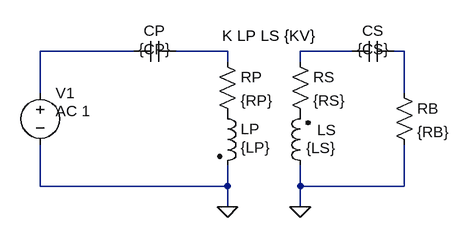
[diagram p0: schematic EVAL_WPTSIM.asc]
EVAL_WPTSIM.asc, the LTspice schematic file:
Version 4
SHEET 1 1000 692
WIRE 176 48 32 48
WIRE 320 48 240 48
WIRE 512 48 432 48
WIRE 592 48 576 48
WIRE 320 64 320 48
WIRE 432 64 432 48
WIRE 32 112 32 48
WIRE 592 112 592 48
WIRE 32 256 32 192
WIRE 320 256 320 224
WIRE 320 256 32 256
WIRE 432 256 432 224
WIRE 592 256 592 192
WIRE 592 256 432 256
WIRE 320 288 320 256
WIRE 432 288 432 256
FLAG 320 288 0
FLAG 432 288 0
SYMBOL voltage 32 96 R0
WINDOW 123 24 44 Left 2
WINDOW 39 0 0 Left 0
WINDOW 3 24 72 Left 2
SYMATTR Value2 AC 1
SYMATTR Value ""
SYMATTR InstName V1
SYMBOL cap 176 64 R270
WINDOW 0 32 32 VTop 2
WINDOW 3 4 32 VTop 2
SYMATTR InstName CP
SYMATTR Value {CP}
SYMBOL ind2 304 128 R0
WINDOW 3 36 68 Left 2
SYMATTR Value {LP}
SYMATTR InstName LP
SYMATTR Type ind
SYMBOL res 304 48 R0
SYMATTR InstName RP
SYMATTR Value {RP}
SYMBOL ind2 448 240 R180
WINDOW 0 -39 71 Left 2
WINDOW 3 -39 43 Left 2
SYMATTR InstName LS
SYMATTR Value {LS}
SYMATTR Type ind
SYMBOL res 416 48 R0
SYMATTR InstName RS
SYMATTR Value {RS}
SYMBOL cap 576 32 R90
WINDOW 0 0 32 VBottom 2
WINDOW 3 28 32 VBottom 2
SYMATTR InstName CS
SYMATTR Value {CS}
SYMBOL res 576 96 R0
SYMATTR InstName RB
SYMATTR Value {RB}
TEXT 312 24 Left 2 !K LP LS {KV}

The netlist it stands for:
* EVAL_WPTSIM.asc
V1 N001 0 AC 1
CP N001 N002 {CP}
LP P001 0 {LP}
RP N002 P001 {RP}
LS 0 P002 {LS}
RS N003 P002 {RS}
CS N004 N003 {CS}
RB N004 0 {RB}
K LP LS {KV}
.backanno
.end